# EAGLE schematic tarjeta (EAGLE 6.4)
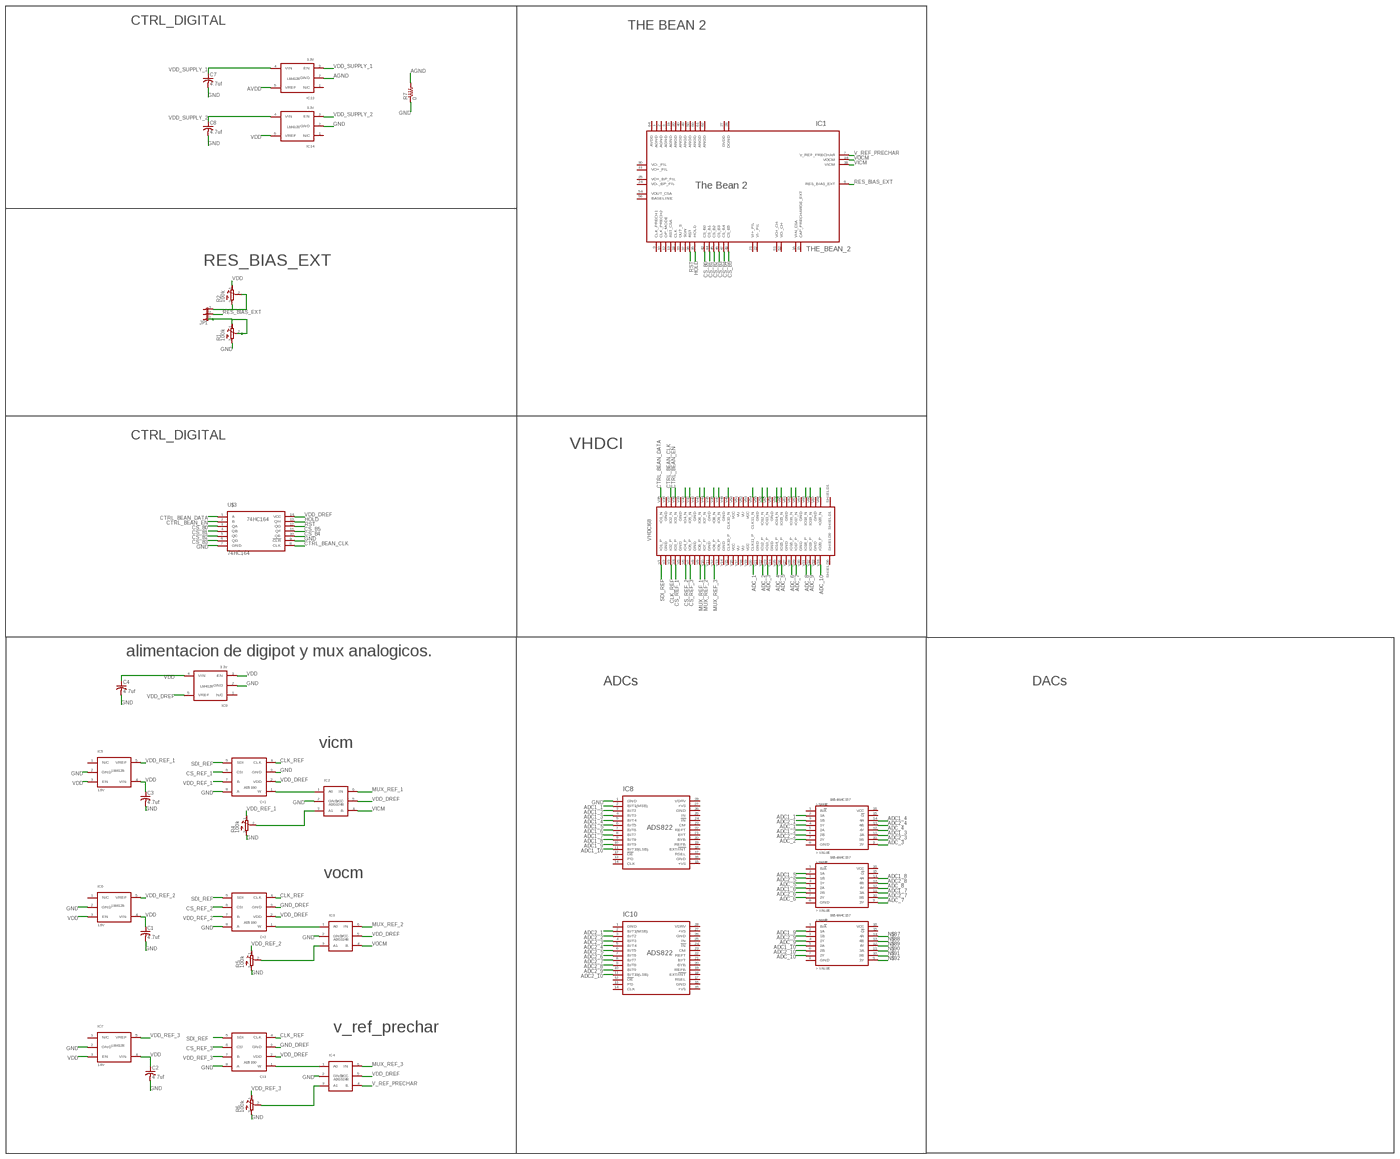
[diagram p0: schematic, sheet 1, overview]
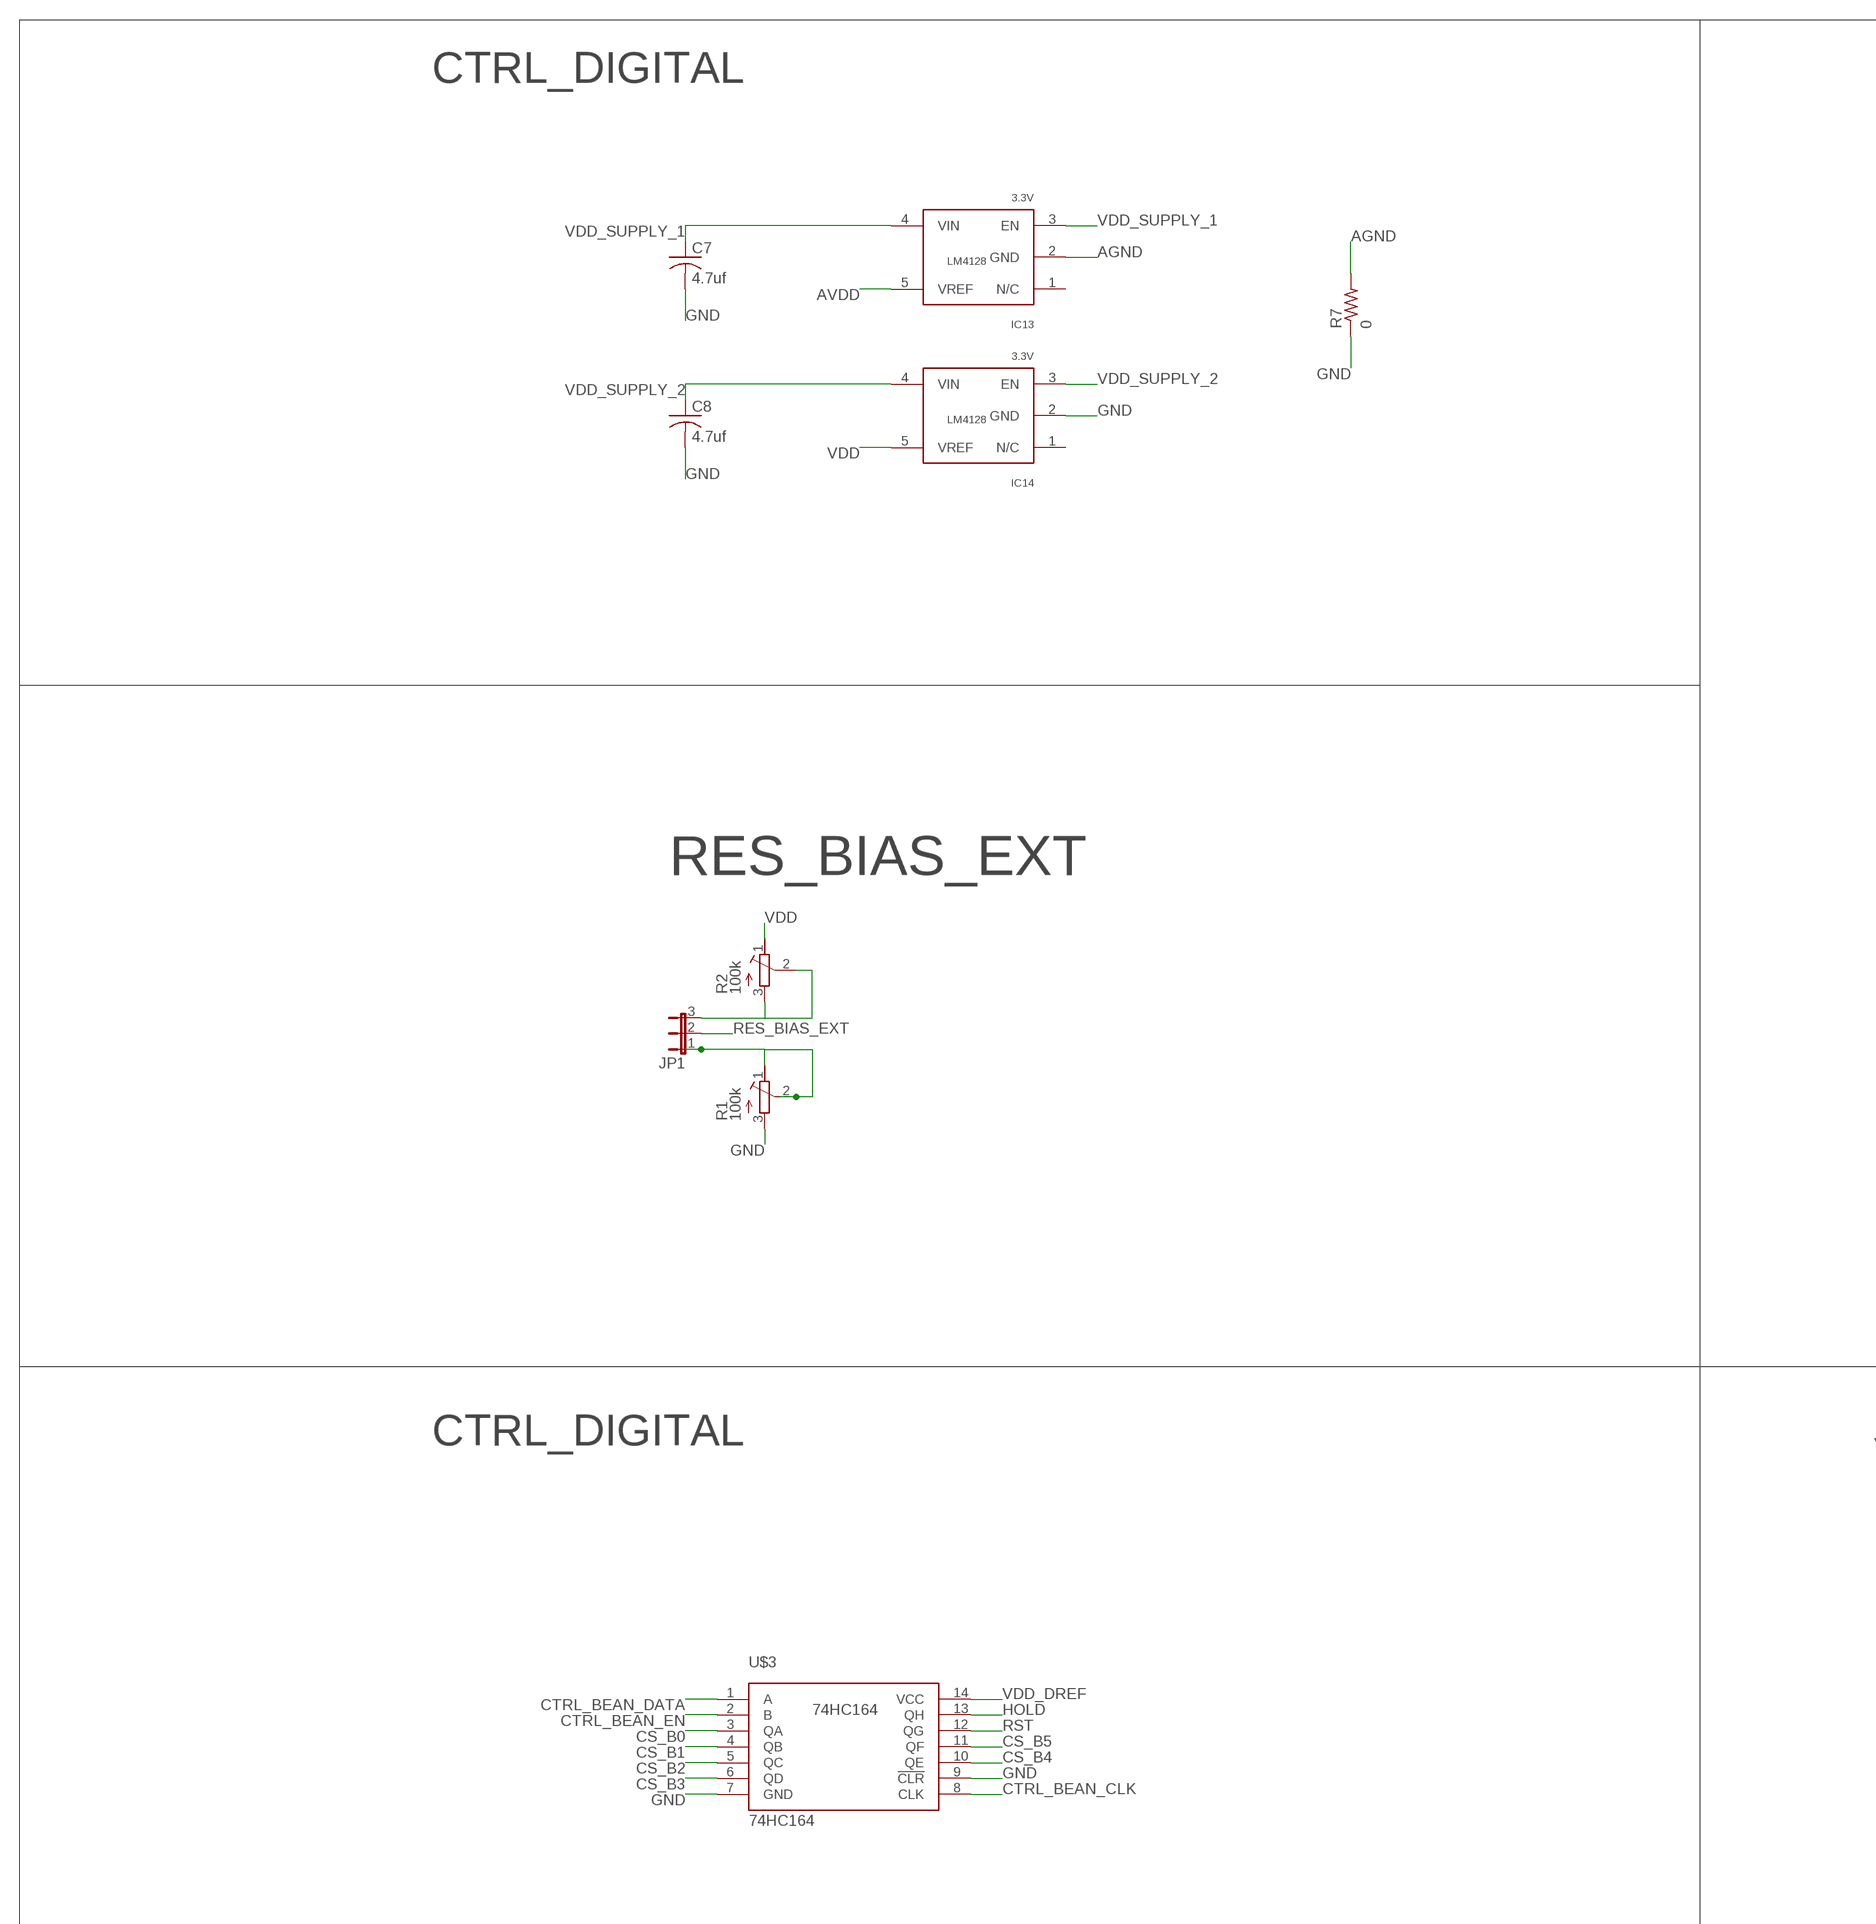
[diagram p1: schematic, sheet 1, part 1 of 4]
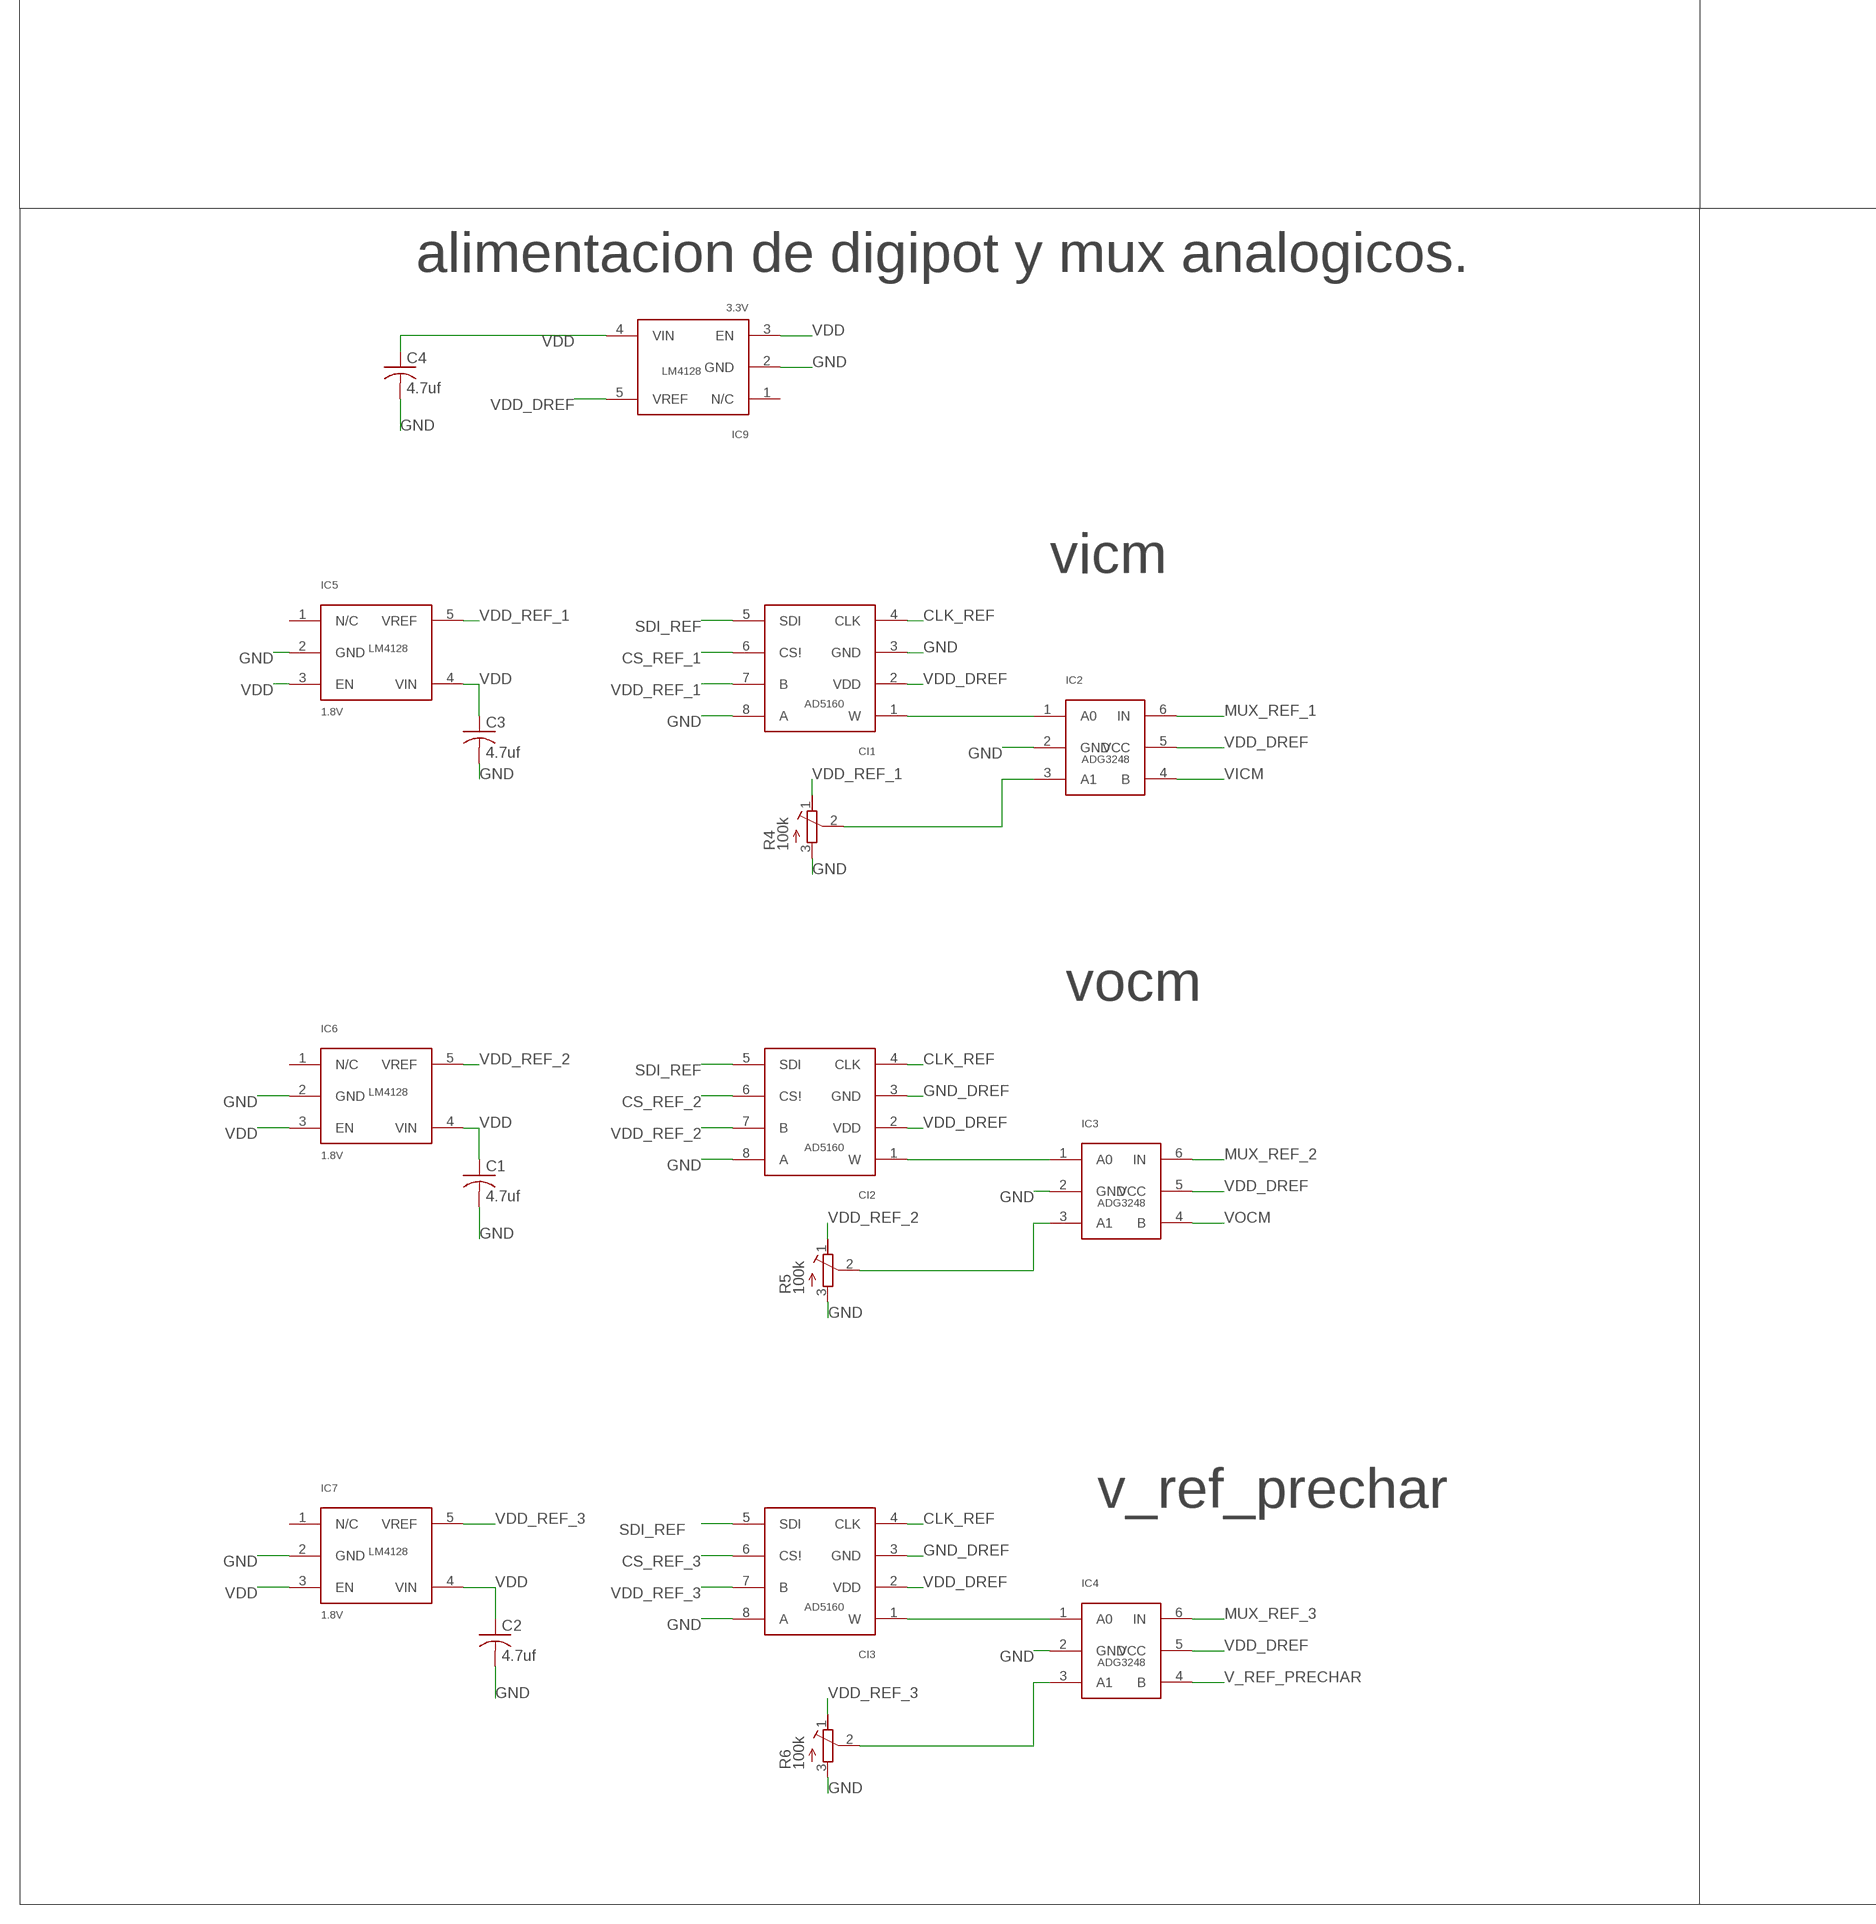
[diagram p2: schematic, sheet 1, part 2 of 4]
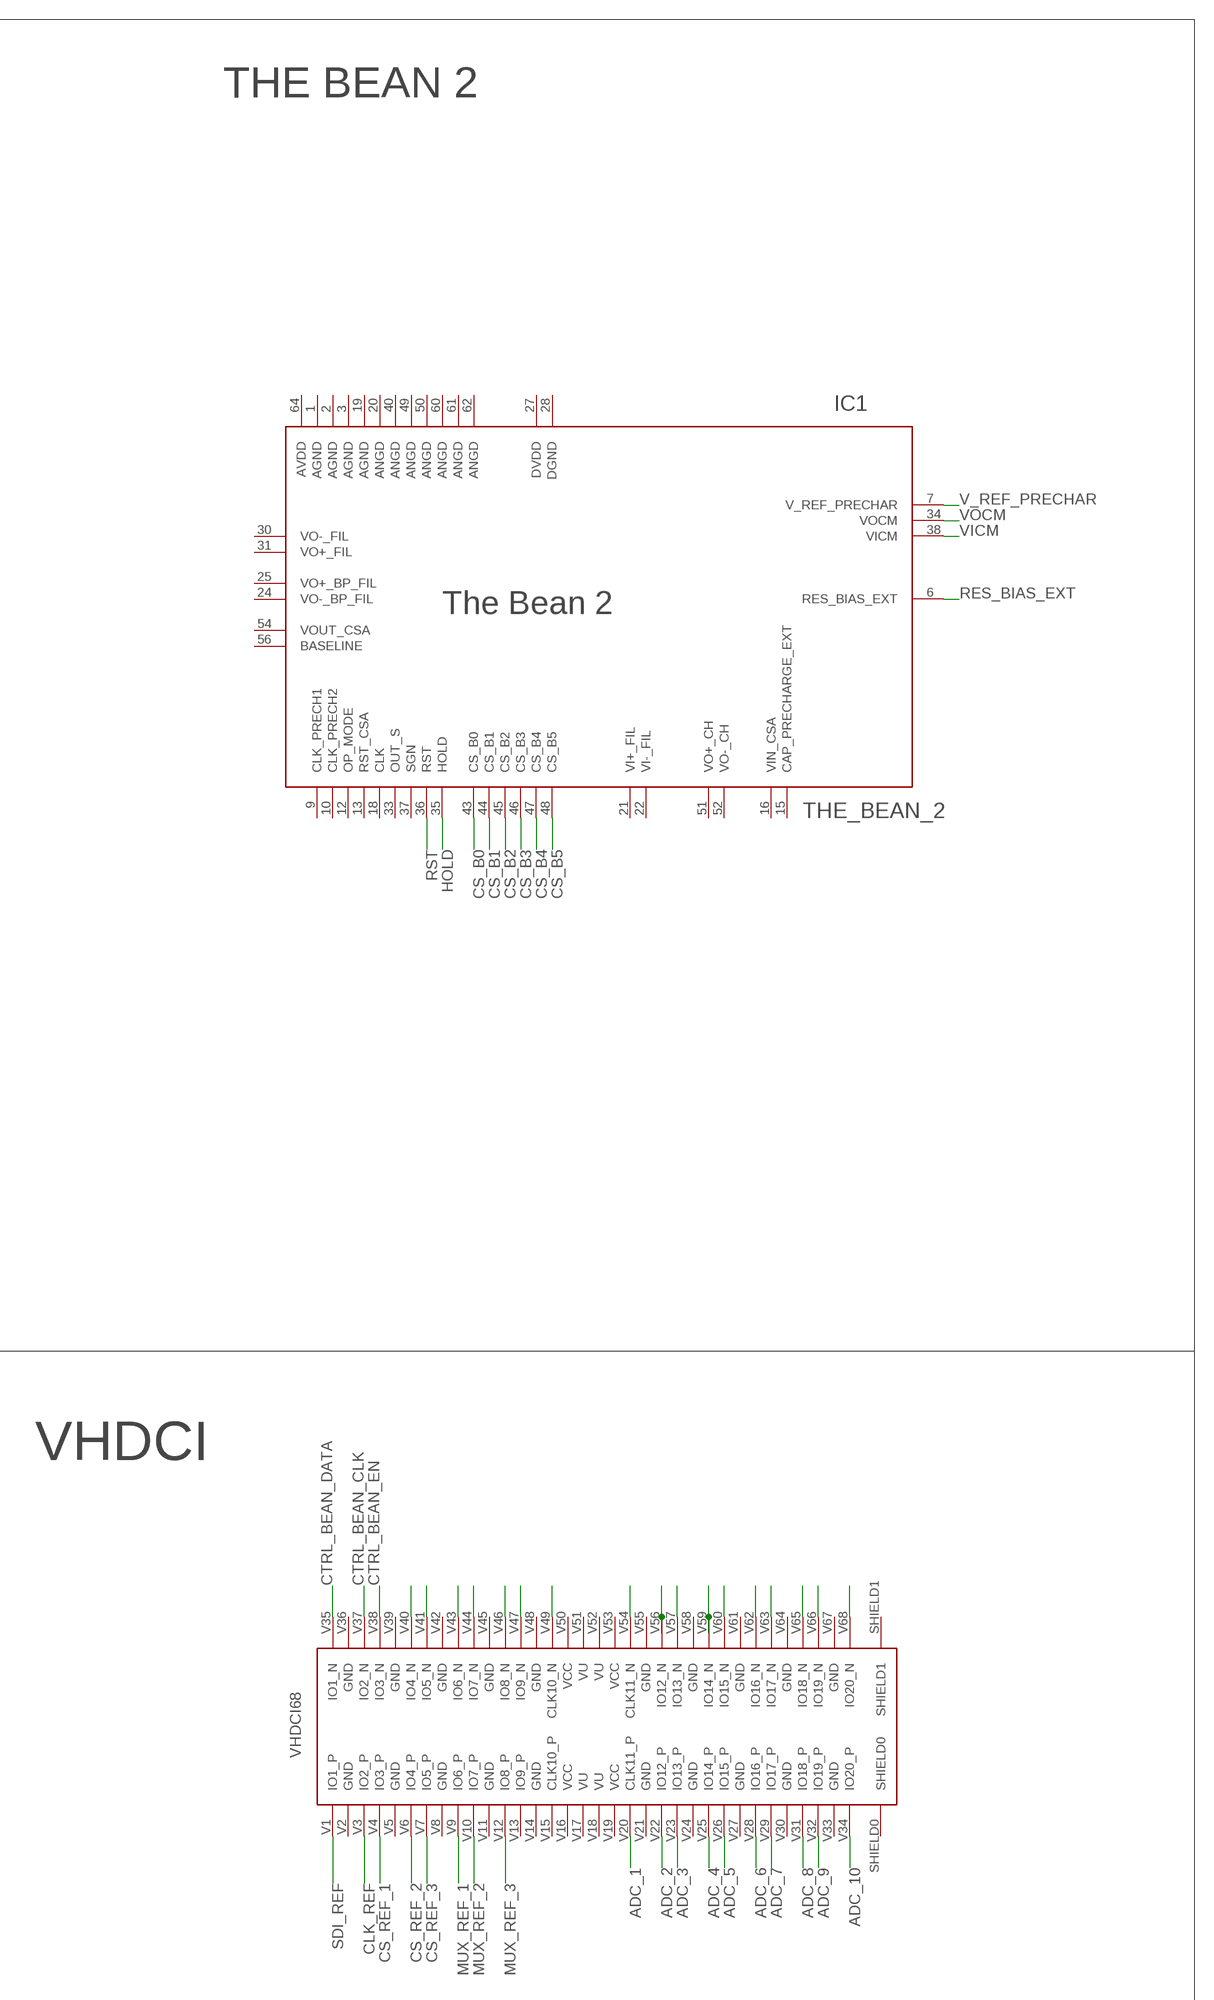
[diagram p3: schematic, sheet 1, part 3 of 4]
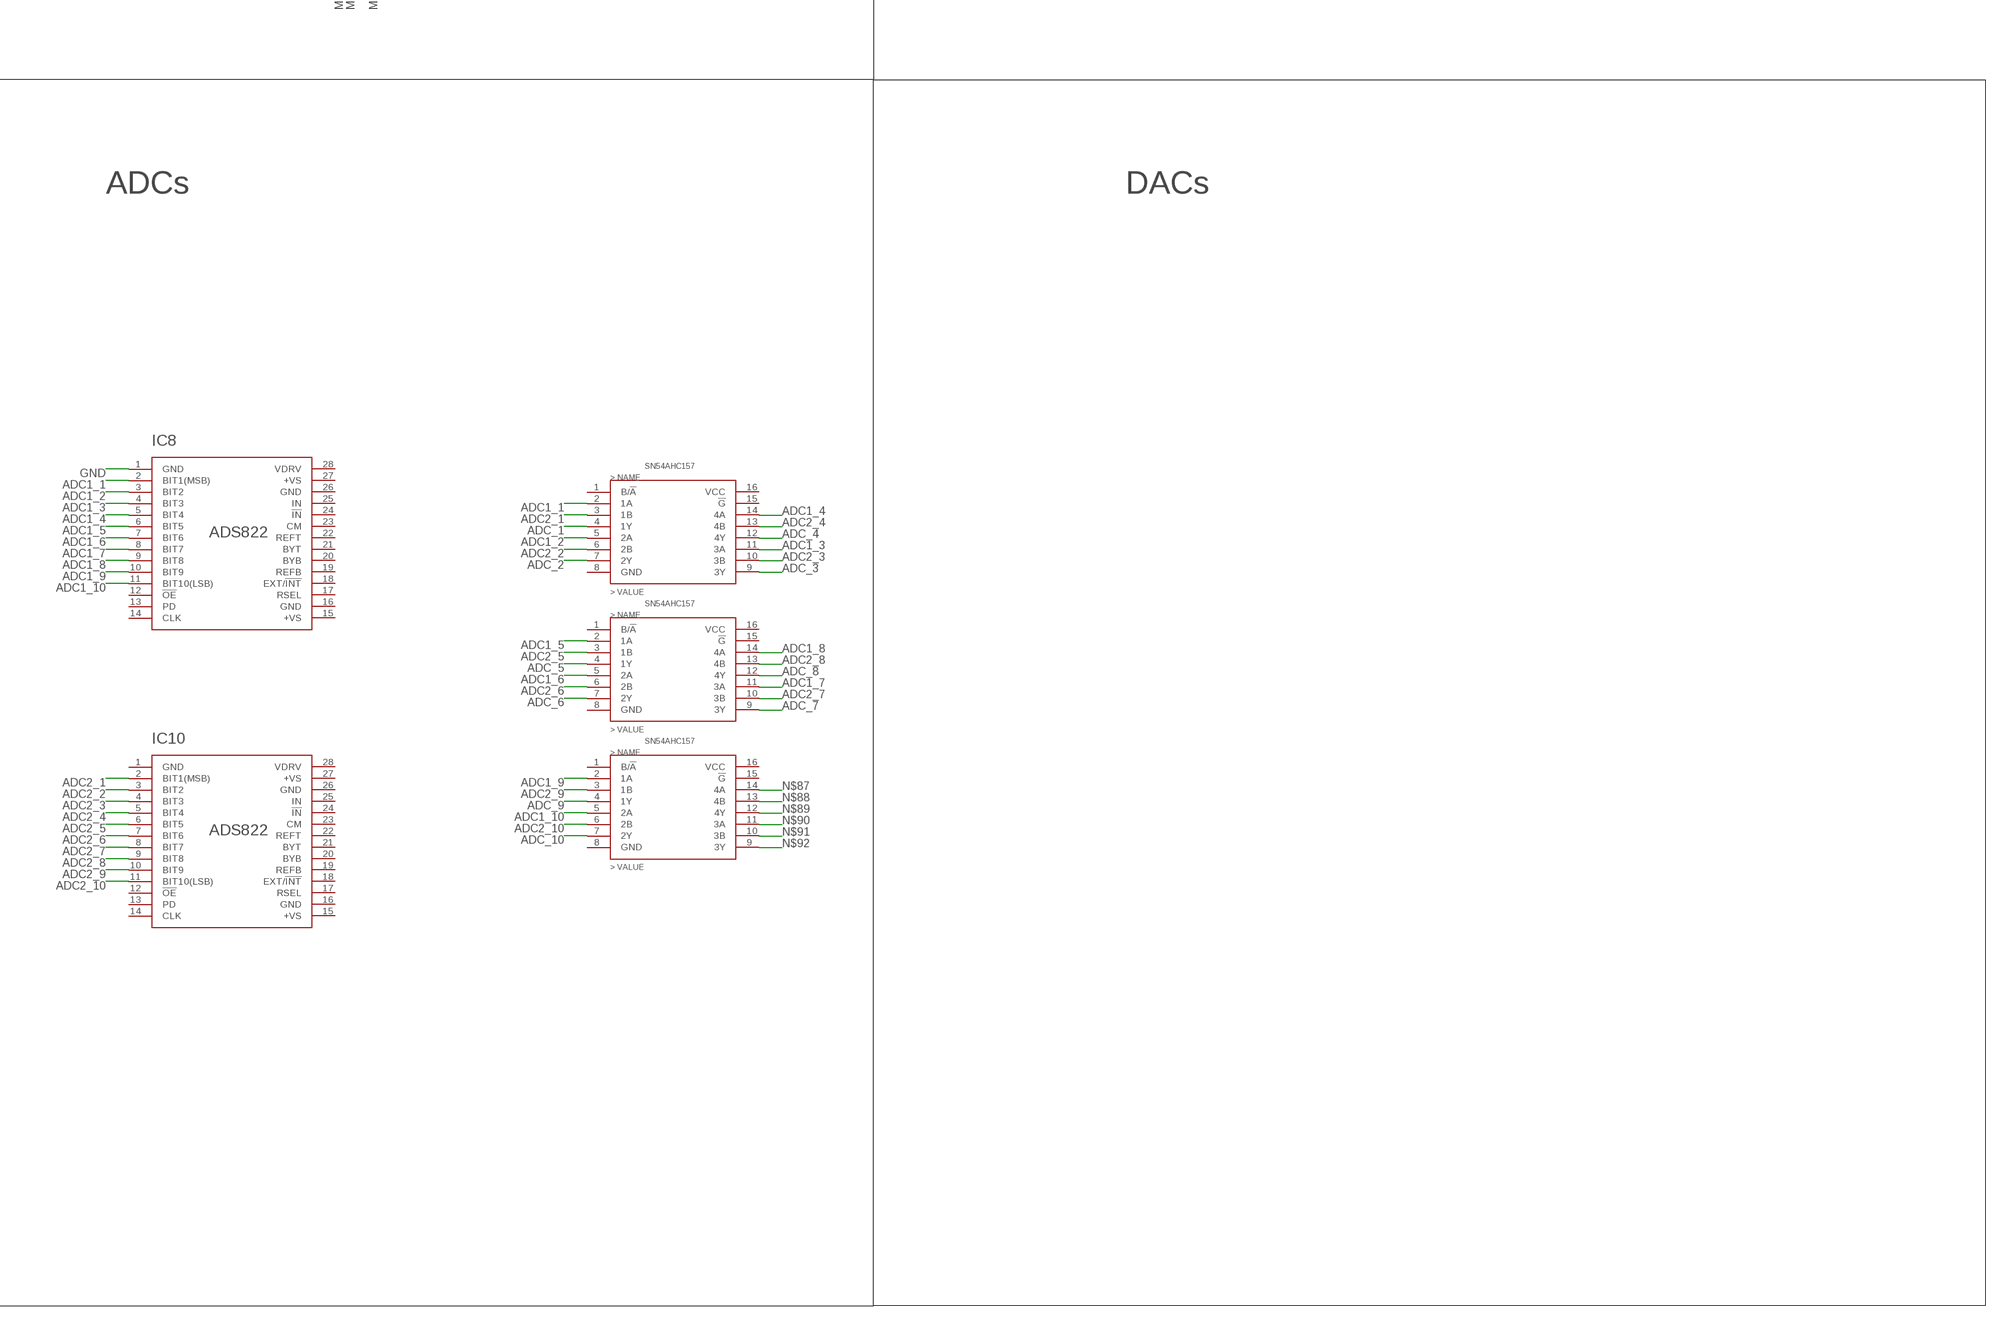
[diagram p4: schematic, sheet 1, part 4 of 4]

## Parts
C1  4.7uf  C-USC0504  [C0504]
C2  4.7uf  C-USC0504  [C0504]
C3  4.7uf  C-USC0504  [C0504]
C4  4.7uf  C-USC0504  [C0504]
C7  4.7uf  C-USC0504  [C0504]
C8  4.7uf  C-USC0504  [C0504]
CI1  AD5160  [SOT23-8]
CI2  AD5160  [SOT23-8]
CI3  AD5160  [SOT23-8]
IC1  THE_BEAN_2  [QFN64]
IC2  ADG3248  [SC70]
IC3  ADG3248  [SC70]
IC4  ADG3248  [SC70]
IC5  1.8V  LM4128  [SOT23-5L]
IC6  1.8V  LM4128  [SOT23-5L]
IC7  1.8V  LM4128  [SOT23-5L]
IC8  ADS822  [SSOP-28]
IC9  3.3V  LM4128  [SOT23-5L]
IC10  ADS822  [SSOP-28]
IC11  SN54AHC157  [TSSOP16]
IC12  SN54AHC157  [TSSOP16]
IC13  3.3V  LM4128  [SOT23-5L]
IC14  3.3V  LM4128  [SOT23-5L]
IC15  SN54AHC157  [TSSOP16]
JP1  JP2E  [JP2]
R1  100k  R-TRIMMT93YA  [RTRIMT93YA]
R2  100k  R-TRIMMT93YA  [RTRIMT93YA]
R4  100k  R-TRIMMT93YA  [RTRIMT93YA]
R5  100k  R-TRIMMT93YA  [RTRIMT93YA]
R6  100k  R-TRIMMT93YA  [RTRIMT93YA]
R7  0  R-US_R0402  [R0402]
U$2  VHDCI68  [VHDCI68]
U$3  74HC164  [TSSOP14]

## Nets
ADC1_1: IC8.2(BIT1(MSB)) IC11.2(1A)
ADC1_2: IC8.3(BIT2) IC11.5(2A)
ADC1_3: IC8.4(BIT3) IC11.11(3A)
ADC1_4: IC8.5(BIT4) IC11.14(4A)
ADC1_5: IC8.6(BIT5) IC12.2(1A)
ADC1_6: IC8.7(BIT6) IC12.5(2A)
ADC1_7: IC8.8(BIT7) IC12.11(3A)
ADC1_8: IC8.9(BIT8) IC12.14(4A)
ADC1_9: IC8.10(BIT9) IC15.2(1A)
ADC1_10: IC8.11(BIT10(LSB)) IC15.5(2A)
ADC2_1: IC10.2(BIT1(MSB)) IC11.3(1B)
ADC2_2: IC10.3(BIT2) IC11.6(2B)
ADC2_3: IC10.4(BIT3) IC11.10(3B)
ADC2_4: IC10.5(BIT4) IC11.13(4B)
ADC2_5: IC10.6(BIT5) IC12.3(1B)
ADC2_6: IC10.7(BIT6) IC12.6(2B)
ADC2_7: IC10.8(BIT7) IC12.10(3B)
ADC2_8: IC10.9(BIT8) IC12.13(4B)
ADC2_9: IC10.10(BIT9) IC15.3(1B)
ADC2_10: IC10.11(BIT10(LSB)) IC15.6(2B)
ADC_1: IC11.4(1Y) U$2.V20(CLK11_P)
ADC_2: IC11.7(2Y) U$2.V22(IO12_P)
ADC_3: IC11.9(3Y) U$2.V23(IO13_P)
ADC_4: IC11.12(4Y) U$2.V25(IO14_P)
ADC_5: IC12.4(1Y) U$2.V26(IO15_P)
ADC_6: IC12.7(2Y) U$2.V28(IO16_P)
ADC_7: IC12.9(3Y) U$2.V29(IO17_P)
ADC_8: IC12.12(4Y) U$2.V31(IO18_P)
ADC_9: IC15.4(1Y) U$2.V32(IO19_P)
ADC_10: IC15.7(2Y) U$2.V34(IO20_P)
AGND: IC13.2(GND) R7.2
AVDD: IC13.5(VREF)
CLK_REF: CI1.4(CLK) CI2.4(CLK) CI3.4(CLK) U$2.V3(IO2_P)
CS_B0: IC1.43(CS_B0) U$3.3(QA)
CS_B1: IC1.44(CS_B1) U$3.4(QB)
CS_B2: IC1.45(CS_B2) U$3.5(QC)
CS_B3: IC1.46(CS_B3) U$3.6(QD)
CS_B4: IC1.47(CS_B4) U$3.10(QE)
CS_B5: IC1.48(CS_B5) U$3.11(QF)
CS_REF_1: CI1.6(CS!) U$2.V4(IO3_P)
CS_REF_2: CI2.6(CS!) U$2.V6(IO4_P)
CS_REF_3: CI3.6(CS!) U$2.V7(IO5_P)
CTRL_BEAN_CLK: U$2.V37(IO2_N) U$3.8(CLK)
CTRL_BEAN_DATA: U$2.V35(IO1_N) U$3.1(A)
CTRL_BEAN_EN: U$2.V38(IO3_N) U$3.2(B)
GND: C1.2 C2.2 C3.2 C4.2 C7.2 C8.2 CI1.3(GND) CI1.8(A) CI2.8(A) CI3.8(A) IC2.2(GND) IC3.2(GND) IC4.2(GND) IC5.2(GND) IC6.2(GND) IC7.2(GND) IC8.1(GND) IC9.2(GND) IC14.2(GND) R1.3(A) R4.3(A) R5.3(A) R6.3(A) R7.1 U$3.7(GND) U$3.9(!CLR)
GND_DREF: CI2.3(GND) CI3.3(GND)
HOLD: IC1.35(HOLD) U$3.13(QH)
MUX_REF_1: IC2.6(IN) U$2.V9(IO6_P)
MUX_REF_2: IC3.6(IN) U$2.V10(IO7_P)
MUX_REF_3: IC4.6(IN) U$2.V12(IO8_P)
N$1: JP1.3 R2.2(S) R2.3(A)
N$2: JP1.1 R1.1(E) R1.2(S)
N$14: U$2.V68(IO20_N)
N$15: U$2.V66(IO19_N)
N$16: U$2.V65(IO18_N)
N$17: CI1.1(W) IC2.1(A0)
N$18: IC2.3(A1) R4.2(S)
N$19: CI2.1(W) IC3.1(A0)
N$20: CI3.1(W) IC4.1(A0)
N$21: IC4.3(A1) R6.2(S)
N$22: U$2.V63(IO17_N)
N$23: U$2.V62(IO16_N)
N$24: U$2.V60(IO15_N)
N$25: U$2.V59(IO14_N)
N$26: U$2.V57(IO13_N)
N$27: U$2.V56(IO12_N)
N$28: IC3.3(A1) R5.2(S)
N$29: U$2.V54(CLK11_N)
N$30: U$2.V49(CLK10_N)
N$34: U$2.V40(IO4_N)
N$35: U$2.V41(IO5_N)
N$36: U$2.V43(IO6_N)
N$37: U$2.V44(IO7_N)
N$38: U$2.V46(IO8_N)
N$39: U$2.V47(IO9_N)
N$87: IC15.14(4A)
N$88: IC15.13(4B)
N$89: IC15.12(4Y)
N$90: IC15.11(3A)
N$91: IC15.10(3B)
N$92: IC15.9(3Y)
RES_BIAS_EXT: IC1.6(RES_BIAS_EXT) JP1.2
RST: IC1.36(RST) U$3.12(QG)
SDI_REF: CI1.5(SDI) CI2.5(SDI) CI3.5(SDI) U$2.V1(IO1_P)
V_REF_PRECHAR: IC1.7(V_REF_PRECHAR) IC4.4(B)
VDD: C1.1 C2.1 C3.1 C4.1 IC5.3(EN) IC5.4(VIN) IC6.3(EN) IC6.4(VIN) IC7.3(EN) IC7.4(VIN) IC9.3(EN) IC9.4(VIN) IC14.5(VREF) R2.1(E)
VDD_DREF: CI1.2(VDD) CI2.2(VDD) CI3.2(VDD) IC2.5(VCC) IC3.5(VCC) IC4.5(VCC) IC9.5(VREF) U$3.14(VCC)
VDD_REF_1: CI1.7(B) IC5.5(VREF) R4.1(E)
VDD_REF_2: CI2.7(B) IC6.5(VREF) R5.1(E)
VDD_REF_3: CI3.7(B) IC7.5(VREF) R6.1(E)
VDD_SUPPLY_1: C7.1 IC13.3(EN) IC13.4(VIN)
VDD_SUPPLY_2: C8.1 IC14.3(EN) IC14.4(VIN)
VICM: IC1.38(VICM) IC2.4(B)
VOCM: IC1.34(VOCM) IC3.4(B)
Unconnected: IC1.9(CLK_PRECH1) IC1.10(CLK_PRECH2) IC1.12(OP_MODE) IC1.13(RST_CSA) IC1.15(CAP_PRECHARGE_EXT) IC1.16(VIN_CSA) IC1.18(CLK) IC1.21(VI+_FIL) IC1.22(VI-_FIL) IC1.24(VO-_BP_FIL) IC1.25(VO+_BP_FIL) IC1.30(VO-_FIL) IC1.31(VO+_FIL) IC1.33(OUT_S) IC1.37(SGN) IC1.51(VO+_CH) IC1.52(VO-_CH) IC1.54(VOUT_CSA) IC1.56(BASELINE) IC5.1(N/C) IC6.1(N/C) IC7.1(N/C) IC8.12(!OE) IC8.13(PD) IC8.14(CLK) IC8.15(+VS) IC8.16(GND) IC8.17(RSEL) IC8.18(EXT/!INT) IC8.19(REFB) IC8.20(BYB) IC8.21(BYT) IC8.22(REFT) IC8.23(CM) IC8.24(!IN) IC8.25(IN) IC8.26(GND) IC8.27(+VS) IC8.28(VDRV) IC9.1(N/C) IC10.1(GND) IC10.12(!OE) IC10.13(PD) IC10.14(CLK) IC10.15(+VS) IC10.16(GND) IC10.17(RSEL) IC10.18(EXT/!INT) IC10.19(REFB) IC10.20(BYB) IC10.21(BYT) IC10.22(REFT) IC10.23(CM) IC10.24(!IN) IC10.25(IN) IC10.26(GND) IC10.27(+VS) IC10.28(VDRV) IC11.1(B/!A) IC11.8(GND) IC11.15(!G) IC11.16(VCC) IC12.1(B/!A) IC12.8(GND) IC12.15(!G) IC12.16(VCC) IC13.1(N/C) IC14.1(N/C) IC15.1(B/!A) IC15.8(GND) IC15.15(!G) IC15.16(VCC) U$2.SHIELD0 U$2.SHIELD1 U$2.V2(GND) U$2.V5(GND) U$2.V8(GND) U$2.V11(GND) U$2.V13(IO9_P) U$2.V14(GND) U$2.V15(CLK10_P) U$2.V21(GND) U$2.V24(GND) U$2.V27(GND) U$2.V30(GND) U$2.V33(GND) U$2.V36(GND) U$2.V39(GND) U$2.V42(GND) U$2.V45(GND) U$2.V48(GND) U$2.V55(GND) U$2.V58(GND) U$2.V61(GND) U$2.V64(GND) U$2.V67(GND)

## Notes on the sheet
- CTRL_DIGITAL
- THE BEAN 2
- RES_BIAS_EXT
- CTRL_DIGITAL
- VHDCI
- alimentacion de digipot y mux analogicos.
- ADCs | DACs
- vicm
- vocm
- v_ref_prechar

## Power pins joined to a net without a drawn wire
AGND: IC1.1(AGND) IC1.2(AGND) IC1.3(AGND) IC1.19(AGND)
ANGD: IC1.20(ANGD) IC1.40(ANGD) IC1.49(ANGD) IC1.50(ANGD) IC1.60(ANGD) IC1.61(ANGD) IC1.62(ANGD)
AVDD: IC1.64(AVDD)
DGND: IC1.28(DGND)
DVDD: IC1.27(DVDD)
VCC: U$2.V16(VCC) U$2.V19(VCC) U$2.V50(VCC) U$2.V53(VCC)
VU: U$2.V17(VU) U$2.V18(VU) U$2.V51(VU) U$2.V52(VU)

## Library data of the parts
C1-C4 C7 C8 = rcl:C-US: CAPACITOR, American symbol
CI1-CI3 = wac:AD5160: Digital potenciometer, package SOT23-8
IC1 = wac:THE_BEAN_2
IC2-IC4 = wac:ADG3248
IC5-IC7 IC9 IC13 IC14 = wac:LM4128
IC8 IC10 = wac:ADS822: ADS822- ti.ANALOG-TO-DIGITAL CONVERTERS,10-Bit, 40MHz Sampling.
IC11 IC12 IC15 = wac:SN54AHC157: SN54AHC157. package TSSOP16. mux 4x2:1
JP1 = jumper:JP2E: JUMPER
R1 R2 R4-R6 = rcl:R-TRIMM: Trimm resistor
R7 = rcl:R-US_: RESISTOR, American symbol
U$2 = tw:VHDCI68: Nexys 3 VHDCI 68pin 0.8mm pitch
U$3 = wac:74HC164: 74HC164. serial to parallel converter. TSSOP14 package TI http://www.ti.com/lit/ds/symlink/sn74hc164.pdf